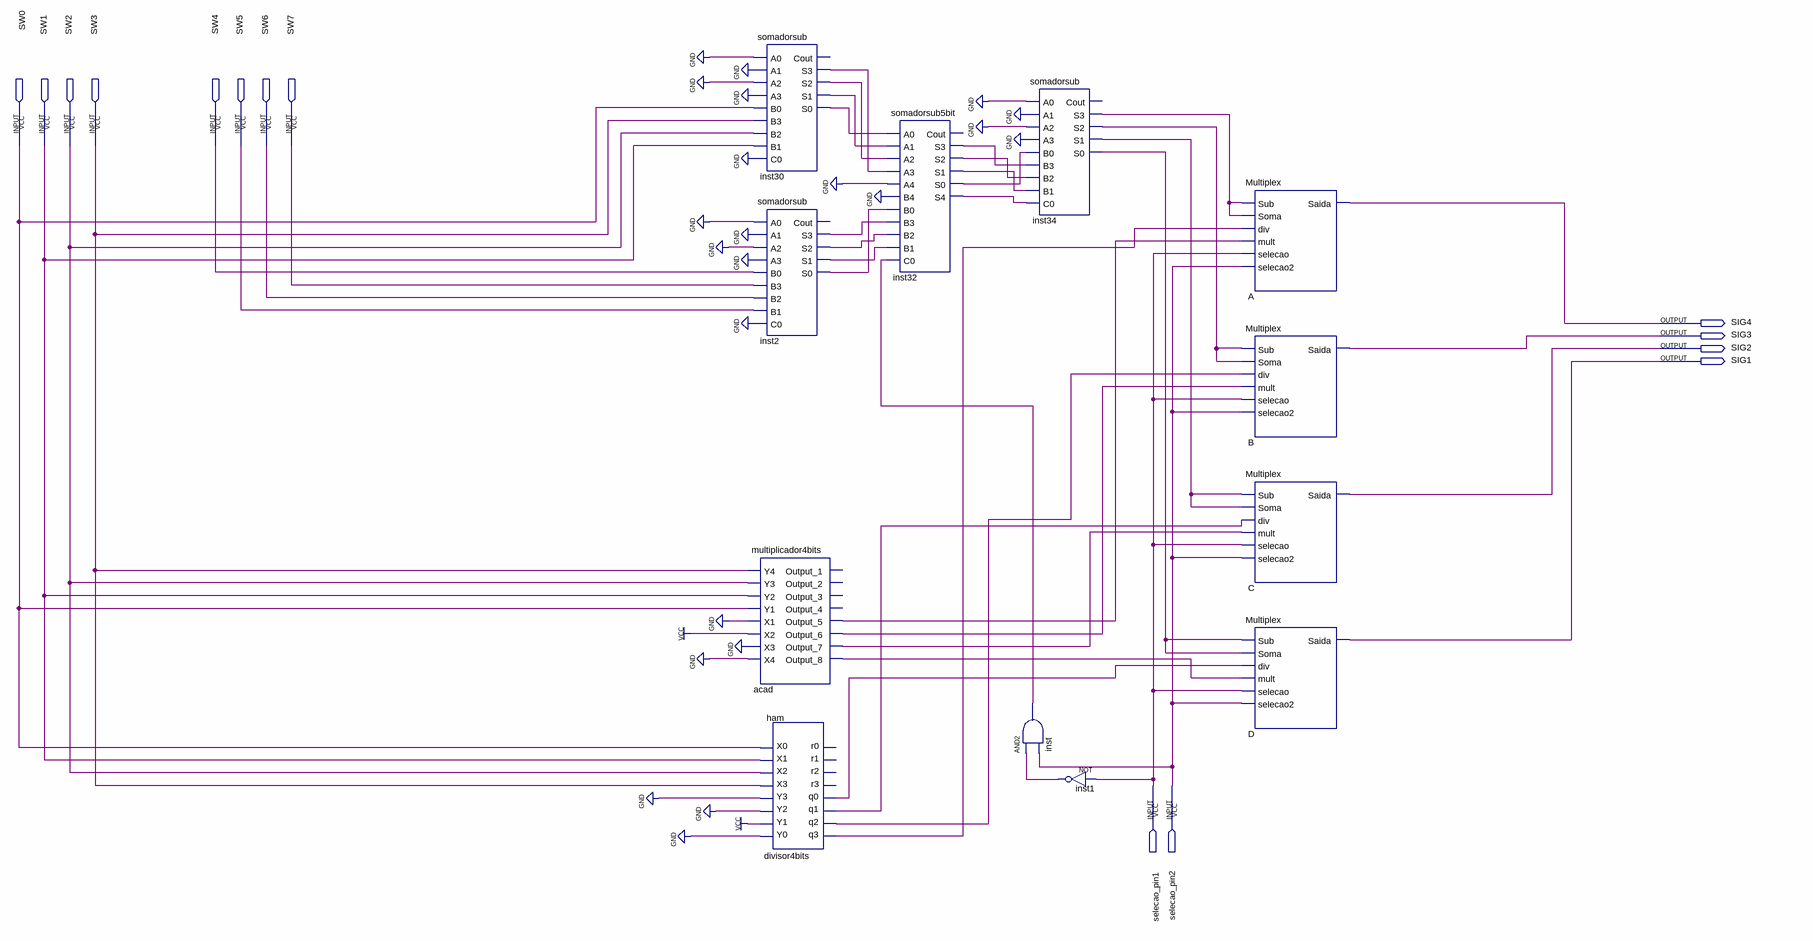
[diagram p0: schematic sheet]
// Quartus schematic ula.bdf as structural Verilog: 12 symbols, 14 pins
module ula (
  input  SW0,
  input  SW1,
  input  SW2,
  input  SW3,
  input  SW4,
  input  SW5,
  input  SW6,
  input  SW7,
  input  selecao_pin1,
  input  selecao_pin2,
  output SIG4,
  output SIG3,
  output SIG2,
  output SIG1
);

  wire acad_output_5, acad_output_6, acad_output_7, acad_output_8, ham_q0, ham_q1, ham_q2, ham_q3, inst1_out,
       inst2_s0, inst2_s1, inst2_s2, inst2_s3, inst30_s0, inst30_s1, inst30_s2, inst30_s3, inst32_s0,
       inst32_s1, inst32_s2, inst32_s3, inst32_s4, inst34_s0, inst34_s1, inst34_s2, inst34_s3, inst_out;

  somadorsub inst30 (
    .A0(1'b0), .A1(1'b0), .A2(1'b0), .A3(1'b0), .B0(SW0), .B3(SW3), .B2(SW2), .B1(SW1), .C0(1'b0),
    .S3(inst30_s3), .S2(inst30_s2), .S1(inst30_s1), .S0(inst30_s0));  // open: Cout
  somadorsub inst2 (
    .A0(1'b0), .A1(1'b0), .A2(1'b0), .A3(1'b0), .B0(SW4), .B3(SW7), .B2(SW6), .B1(SW5), .C0(1'b0),
    .S3(inst2_s3), .S2(inst2_s2), .S1(inst2_s1), .S0(inst2_s0));  // open: Cout
  multiplicador4bits acad (
    .Y4(SW3), .Y3(SW2), .Y2(SW1), .Y1(SW0), .X1(1'b0), .X2(1'b1), .X3(1'b0), .X4(1'b0),
    .Output_5(acad_output_5), .Output_6(acad_output_6), .Output_7(acad_output_7), .Output_8(acad_output_8));  // open: Output_1, Output_2, Output_3, Output_4
  divisor4bits ham (
    .Y0(1'b0), .Y1(1'b1), .Y2(1'b0), .Y3(1'b0), .X3(SW3), .X2(SW2), .X1(SW1), .X0(SW0), .q3(ham_q3),
    .q2(ham_q2), .q1(ham_q1), .q0(ham_q0));  // open: r3, r2, r1, r0
  somadorsub5bit inst32 (
    .A0(inst30_s0), .A1(inst30_s1), .A2(inst30_s2), .A3(inst30_s3), .A4(1'b0), .B4(1'b0), .B0(inst2_s0),
    .B3(inst2_s3), .B2(inst2_s2), .B1(inst2_s1), .C0(inst_out), .S3(inst32_s3), .S2(inst32_s2),
    .S1(inst32_s1), .S0(inst32_s0), .S4(inst32_s4));  // open: Cout
  and inst (inst_out, inst1_out, selecao_pin2);
  somadorsub inst34 (
    .A0(1'b0), .A1(1'b0), .A2(1'b0), .A3(1'b0), .B0(inst32_s0), .B3(inst32_s3), .B2(inst32_s2),
    .B1(inst32_s1), .C0(inst32_s4), .S3(inst34_s3), .S2(inst34_s2), .S1(inst34_s1), .S0(inst34_s0));  // open: Cout
  not inst1 (inst1_out, selecao_pin1);
  Multiplex A (
    .Sub(inst34_s3), .Soma(inst34_s3), .div(ham_q3), .mult(acad_output_5), .selecao(selecao_pin1),
    .selecao2(selecao_pin2), .Saida(SIG4));
  Multiplex B (
    .Sub(inst34_s2), .Soma(inst34_s2), .div(ham_q2), .mult(acad_output_6), .selecao(selecao_pin1),
    .selecao2(selecao_pin2), .Saida(SIG3));
  Multiplex C (
    .Sub(inst34_s1), .Soma(inst34_s1), .div(ham_q1), .mult(acad_output_7), .selecao(selecao_pin1),
    .selecao2(selecao_pin2), .Saida(SIG2));
  Multiplex D (
    .Sub(inst34_s0), .Soma(inst34_s0), .div(ham_q0), .mult(acad_output_8), .selecao(selecao_pin1),
    .selecao2(selecao_pin2), .Saida(SIG1));
endmodule
